# Altium project UZ_per_cb_upgrade.PrjPcb (part 3 of 3)

## Sheet SupplyMonitoring.SchDoc
size A4; SheetNumber: 9
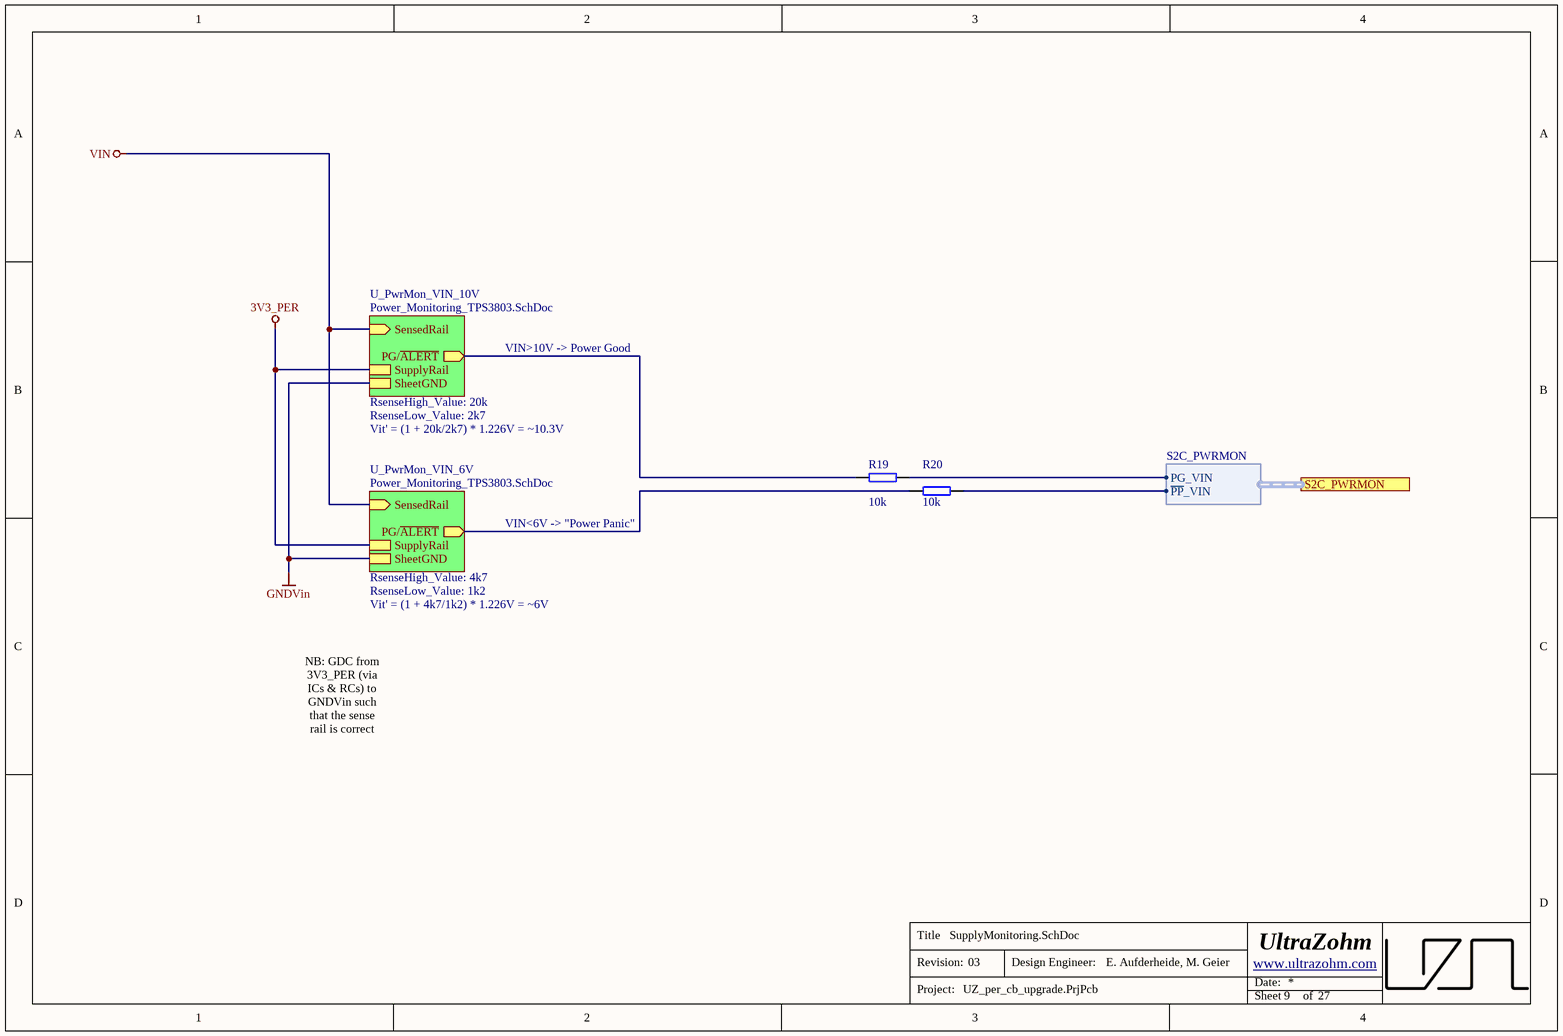
[diagram p18: SupplyMonitoring.SchDoc]

### Parts
R19  10k  [R_0603_TE]
R20  10k  [R_0603_TE]

### Sub-sheets
U_PwrMon_VIN_6V = Power_Monitoring_TPS3803.SchDoc (file not in this document): SensedRail (in), PG/~{ALERT} (out), SupplyRail, SheetGND  | RsenseHigh_Value: 4k7; RsenseLow_Value: 1k2; SubSheet_SheetNumber: 10.1
U_PwrMon_VIN_10V = Power_Monitoring_TPS3803.SchDoc (file not in this document): SensedRail (in), PG/~{ALERT} (out), SupplyRail, SheetGND  | RsenseHigh_Value: 20k; RsenseLow_Value: 2k7; SubSheet_SheetNumber: 10.2

### Ports
S2C_PWRMON (harness S2C_PWRMON)

### Harnesses
S2C_PWRMON: PG_VIN, ~{PP}_VIN

### Nets
3V3_PER: sheet U_PwrMon_VIN_10V/SupplyRail, sheet U_PwrMon_VIN_6V/SupplyRail
GNDVin: sheet U_PwrMon_VIN_10V/SheetGND, sheet U_PwrMon_VIN_6V/SheetGND
VIN: sheet U_PwrMon_VIN_10V/SensedRail, sheet U_PwrMon_VIN_6V/SensedRail
NetR19_1: R19.1 ; sheet U_PwrMon_VIN_10V/PG/~{ALERT}
NetR19_2: R19.2 ; port S2C_PWRMON.PG_VIN
NetR20_1: R20.1 ; sheet U_PwrMon_VIN_6V/PG/~{ALERT}
NetR20_2: R20.2 ; port S2C_PWRMON.~{PP}_VIN

### Notes on the sheet
- VIN>10V -> Power Good
- Vit' = (1 + 20k/2k7) * 1.226V = ~10.3V
- VIN<6V -> "Power Panic"
- Vit' = (1 + 4k7/1k2) * 1.226V = ~6V
- NB: GDC from 3V3_PER (via ICs & RCs) to GNDVin such that the sense rail is correct
- Title
- Revision:
- Design Engineer:
- Date:
- Project:
- Sheet
- of

### Library data of the parts
R19 R20 = UZgen_R_0603_10k: Generic resistor; Manufacturer: UZgen; Tolerance: 1 %; Created from: AGeiger; Value: 10k; Manufacturer Part Number: UZgen_R_0603_10k; PartID: 1; Created On: 02/07/2024 14:34:53; Device Package: 0603; Mounting Type: SMD; Last Updated: 02/07/2024 14:37:16

## Sheet ThermalExtSens.SchDoc
size A4; SheetNumber: 26
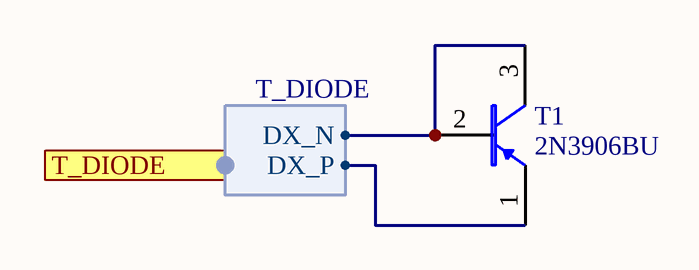
[diagram p19: ThermalExtSens.SchDoc]

### Parts
T1  2N3906BU  [TO-92-3]

### Ports
T_DIODE (harness T_DIODE)

### Harnesses
T_DIODE: DX_P, DX_N

### Nets
NetT1_1: T1.1(EMITTER) ; port T_DIODE.DX_P
NetT1_2: T1.2(BASIS) T1.3(COLLECTOR) ; port T_DIODE.DX_N

### Notes on the sheet
- Title
- Revision:
- Design Engineer:
- Date:
- Project:
- Sheet
- of

### Library data of the parts
T1 = 2N3906BU: Bipolartransistor, PNP; Manufacturer: onsemi; Number Of Channels: single; Collector Emitter Voltage: 40V; Power Dissipation: 625mW; Value: 40V; Created from: MGeier; Manufacturer Part Number: 2N3906BU; PartID: 4; Created On: 29/03/2025 21:55:00; ComponentLink1Description: Datasheet; ComponentLink1URL: https://www.onsemi.com/download/data-sheet/pdf/2n3906-d.pdf; Component Type: Bipolartransistor; Device Package: TO-92-3; Last Updated: 29/03/2025 21:55:00; Mounting Type: THT; Operating Temperature: -55 - 150°C; Series: 2N3906; Supplier 1: LCSC; Supplier Part Number 1: C124483; Type: Bipolartransistor; Collector Basis Voltage: 40V; Polarization: PNP; Live Cycle Status: 1; LCSC Part Number: C124483

## Sheet isoDebug-Isolation.SchDoc
size A4
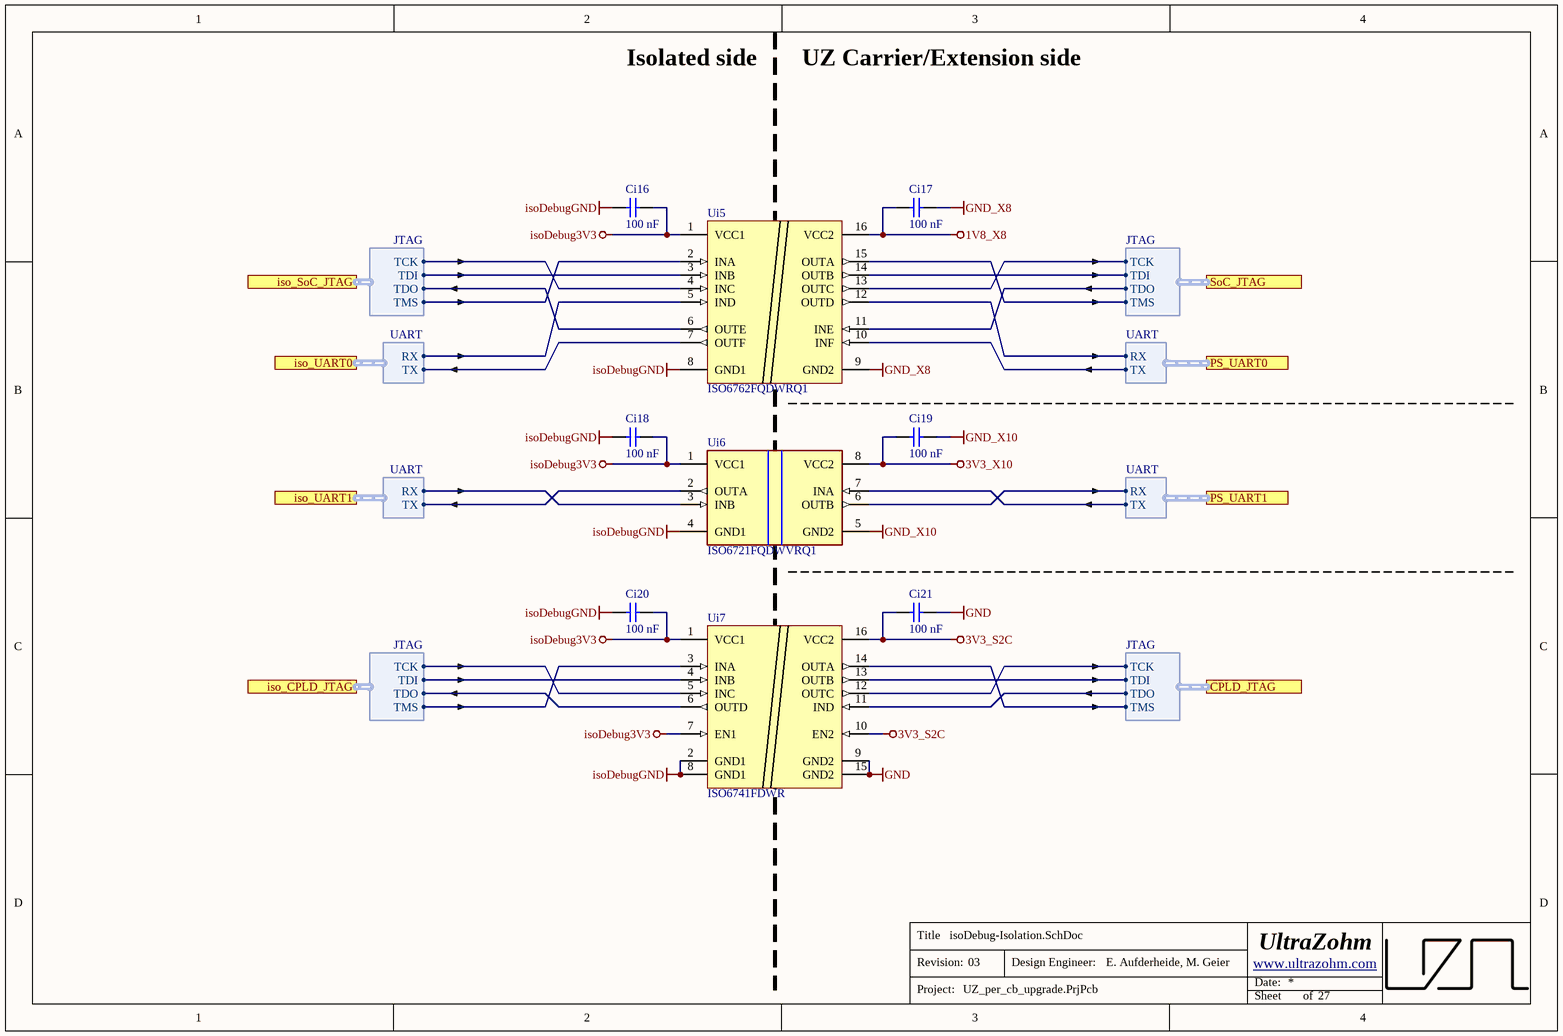
[diagram p20: isoDebug-Isolation.SchDoc]

### Parts
Ci16  100 nF  [C_0402_TE]
Ci17  100 nF  [C_0402_TE]
Ci18  100 nF  [C_0402_TE]
Ci19  100 nF  [C_0402_TE]
Ci20  100 nF  [C_0402_TE]
Ci21  100 nF  [C_0402_TE]
Ui5  ISO6762FQDWRQ1  [SOIC127P1030X265-16N]
Ui6  ISO6721FQDWVRQ1  [FP-DWV0008A-IPC_A]
Ui7  ISO6741FDWR  [SOIC127P1030X265-16N]

### Ports
CPLD_JTAG (harness JTAG), iso_CPLD_JTAG (harness JTAG), iso_SoC_JTAG (harness JTAG), iso_UART0 (harness UART), iso_UART1 (harness UART), PS_UART0 (harness UART), PS_UART1 (harness UART), SoC_JTAG (harness JTAG)

### Harnesses
JTAG: TCK, TDI, TDO, TMS
UART: RX, TX

### Nets
1V8_X8: Ci17.2 Ui5.16(VCC2)
3V3_S2C: Ci21.2 Ui7.10(EN2) Ui7.16(VCC2)
3V3_X10: Ci19.2 Ui6.8(VCC2)
GND: Ci21.1 Ui7.9(GND2) Ui7.15(GND2)
GND_X8: Ci17.1 Ui5.9(GND2)
GND_X10: Ci19.1 Ui6.5(GND2)
isoDebug3V3: Ci16.1 Ci18.1 Ci20.1 Ui5.1(VCC1) Ui6.1(VCC1) Ui7.1(VCC1) Ui7.7(EN1)
isoDebugGND: Ci16.2 Ci18.2 Ci20.2 Ui5.8(GND1) Ui6.4(GND1) Ui7.2(GND1) Ui7.8(GND1)
NetUi5_2: Ui5.2(INA) ; port iso_SoC_JTAG.TMS
NetUi5_3: Ui5.3(INB) ; port iso_SoC_JTAG.TDI
NetUi5_4: Ui5.4(INC) ; port iso_SoC_JTAG.TCK
NetUi5_5: Ui5.5(IND) ; port iso_UART0.RX
NetUi5_6: Ui5.6(OUTE) ; port iso_SoC_JTAG.TDO
NetUi5_7: Ui5.7(OUTF) ; port iso_UART0.TX
NetUi5_10: Ui5.10(INF) ; port PS_UART0.TX
NetUi5_11: Ui5.11(INE) ; port SoC_JTAG.TDO
NetUi5_12: Ui5.12(OUTD) ; port PS_UART0.RX
NetUi5_13: Ui5.13(OUTC) ; port SoC_JTAG.TCK
NetUi5_14: Ui5.14(OUTB) ; port SoC_JTAG.TDI
NetUi5_15: Ui5.15(OUTA) ; port SoC_JTAG.TMS
NetUi6_2: Ui6.2(OUTA) ; port iso_UART1.TX
NetUi6_3: Ui6.3(INB) ; port iso_UART1.RX
NetUi6_6: Ui6.6(OUTB) ; port PS_UART1.RX
NetUi6_7: Ui6.7(INA) ; port PS_UART1.TX
NetUi7_3: Ui7.3(INA) ; port iso_CPLD_JTAG.TMS
NetUi7_4: Ui7.4(INB) ; port iso_CPLD_JTAG.TDI
NetUi7_5: Ui7.5(INC) ; port iso_CPLD_JTAG.TCK
NetUi7_6: Ui7.6(OUTD) ; port iso_CPLD_JTAG.TDO
NetUi7_11: Ui7.11(IND) ; port CPLD_JTAG.TDO
NetUi7_12: Ui7.12(OUTC) ; port CPLD_JTAG.TCK
NetUi7_13: Ui7.13(OUTB) ; port CPLD_JTAG.TDI
NetUi7_14: Ui7.14(OUTA) ; port CPLD_JTAG.TMS

### Notes on the sheet
- Isolated side
- UZ Carrier/Extension side
- Title
- Revision:
- Design Engineer:
- Date:
- Project:
- Sheet
- of

### Library data of the parts
Ci16-Ci21 = UZgen_C_0402_100nF_50V_X7R: Generic capacitor; Manufacturer: UZgen; Tolerance: 10 %; Created from: UZgenTool; Voltage: 50V; Manufacturer Part Number: UZgen_C_0402_100nF_50V_X7R; PartID: 3431; Created On: 02/08/2024 11:17:51; Device Package: 0402; Last Updated: 02/08/2024 11:17:51; Mounting Type: SMD; Value: 100 nF; Technology: X7R
Ui5 = ISO6762FQDWRQ1: ISO676x General-Purpose Six-Channel Reinforced Digital Isolators with Robust EMC; Manufacturer: Texas Instruments; Created from: FRosner; Manufacturer Part Number: ISO6762FQDWRQ1; PartID: 13; Created On: 23/02/2025 18:15:58; ComponentLink1Description: Datasheet; ComponentLink1URL: https://www.ti.com/lit/ds/symlink/iso6762-q1.pdf; Component Type: Digital Isolator; Device Package: SOIC-16; Last Updated: 24/03/2025 19:50:00; Mounting Type: SMD; Operating Temperature: -40 to +125 °C; Series: ISO6762; Supplier 1: Mouser; Supplier Part Number 1: 595-ISO6762FQDWRQ1; Supplier 2: LCSC; Supplier Part Number 2: C5216383; Type: Digital Isolator; Value: ISO6762FQDWRQ1; LCSC Part Number: C5216383
Ui6 = ISO6721FQDWVRQ1: General Purpose Reinforced and Basic Dual-Channel Automotive Digital Isolators with Robust EMC; Manufacturer: Texas Instruments; Created from: FRosner; Manufacturer Part Number: ISO6721FQDWVRQ1; PartID: 14; Created On: 23/02/2025 18:26:28; ComponentLink1Description: Datasheet; ComponentLink1URL: https://www.ti.com/lit/ds/symlink/iso6721-q1.pdf; Component Type: Digital Isolator; Device Package: SOIC-8; Last Updated: 26/03/2025 16:07:30; Mounting Type: SMD; Operating Temperature: -40 to +125 °C; Series: ISO6721; Supplier 1: Mouser; Supplier Part Number 1: 595-ISO6721FQDWVRQ1; Supplier 2: LCSC; Supplier Part Number 2: C5216428; Type: Digital Isolator; Value: ISO6721FQDWVRQ1; LCSC Part Number: C5216428
Ui7 = ISO6741FDWR: Digital Isolators General-purpose, quad-channel, 3/1 digital isolator 16-SOIC -40 to 125; Manufacturer: Texas Instruments; Created from: FRosner; Manufacturer Part Number: ISO6741FDWR; PartID: 6; Created On: 18/06/2024 13:06:34; ComponentLink1Description: Datasheet; ComponentLink1URL: https://www.ti.com/lit/ds/symlink/iso6741.pdf; Component Type: Digital Isolator; Device Package: SOIC-16; Last Updated: 24/03/2025 19:50:00; Mounting Type: SMD; Operating Temperature: -40 to +125 °C; Series: ISO6741; Supplier 1: Mouser; Supplier Part Number 1: 595-ISO6741FDWR; Supplier 2: LCSC; Supplier Part Number 2: C5216433; Type: Digital Isolator; Value: ISO6741FDWR; LCSC Part Number: C5216433

## Nets that join several sheets
1V8_X8: isoDebug-Connectors (CB_X8.06), isoDebug-Isolation (Ci17.2 Ui5.16)
3V3_PER: Samtec_Connectors (11 pins), S2C_FrontpanelInterface (12 pins)
3V3_S2C: Top_sheet (NT2.2), RTC (C10.1 C11.1 U1.1 U1.8), U_EEPROM_MAC0 (C10A.1 U4A.8), U_EEPROM_MAC1 (C10B.1 U4B.8), EEPROM (5 pins), S2C (11 pins), S2C_IOs3V3 (25 pins), S2C_IOs3V3_SelectSPI (6 pins), S2C_IOs1V8 (11 pins), S2C_IOsVIO (X1.06), S2C_FrontpanelInterface (R52.1), S2C_SelectJTAG (8 pins), isoDebug-Connectors (R56.2), X10-Isolation (C75.2 C77.2 U15.1 U16.16), X13-Isolation (6 pins), isoDebug-Isolation (Ci21.2 Ui7.10 Ui7.16)
3V3_SSD: SSD (24 pins), Power_Supplies (D2.2 R15.1)
3V3_X10: Samtec_Connectors (8 pins), X10-Isolation (C74.1 C76.1 U15.8 U16.1), isoDebug-Isolation (Ci19.2 Ui6.8)
3V3_X13: Samtec_Connectors (CB_X13.1 CB_X13.4 CB_X13.7 CB_X13.10), X13-Isolation (6 pins)
GND: Top_sheet (NT1.2 R1.2 Rc1.2), RTC (7 pins), U_EEPROM_MAC0 (C10A.2 U4A.1 U4A.3 U4A.4), U_EEPROM_MAC1 (C10B.2 U4B.1 U4B.3 U4B.4), EEPROM (C12.2 U2.3 U2.4), S2C (16 pins), S2C_IOs3V3 (20 pins), S2C_IOs3V3_SelectSPI (C51.1 C52.1 U6.2 U7.2), S2C_IOs1V8 (17 pins), S2C_IOsVIO (C63.2 C64.1 X1.07), S2C_SelectJTAG (11 pins), isoDebug-Connectors (R55.2), X10-Isolation (5 pins), X13-Isolation (9 pins), isoDebug-Isolation (Ci21.1 Ui7.9 Ui7.15)
GND_FP: Samtec_Connectors (11 pins), S2C_FrontpanelInterface (10 pins)
GND_X8: isoDebug-Connectors (CB_X8.01 CB_X8.02), isoDebug-Isolation (Ci17.1 Ui5.9)
GND_X10: Samtec_Connectors (C1.1 C2.2 CB_X10.2 CB_X10.8), X10-Isolation (5 pins), isoDebug-Isolation (Ci19.1 Ui6.5)
GND_X13: Samtec_Connectors (CB_X13.11 CB_X13.14 CB_X13.17 CB_X13.20), X13-Isolation (9 pins)
GNDSSD: Top_sheet (R1.1), SSD (49 pins), Power_Supplies (6 pins)
GNDVin: Samtec_Connectors (CB_X18.3 CB_X18.4 CB_X18.16 CB_X18.17), Power_Supplies (C26.2 C28.2 R18.2 U4.2)
isoDebugGND: isoDebug-Connectors (9 pins), isoDebug-Isolation (7 pins)
VIN: Samtec_Connectors (6 pins), Power_Supplies (C26.1 C28.1 U4.1), S2C_FrontpanelInterface (C72.2 U14.1 U14.2)
1V8_S2C: S2C_IOs1V8 (8 pins), S2C_IOsVIO (X1.05)
DONE: S2C_IOs3V3 (U5.76), S2C_SelectJTAG (R42.1 R43.2)
EEPROM_MAC_A1-: Top_sheet (NT1.1), U_EEPROM_MAC0 (U4A.2)
EEPROM_MAC_A1-: Top_sheet (NT2.1), U_EEPROM_MAC1 (U4B.2)
FOUT: RTC (U1.4), S2C_IOs3V3 (U5.63)
FP_SysLEDs: S2C_IOs3V3 (U5.40), S2C_FrontpanelInterface (R52.2 R53.1)
FP_UsrLED1: S2C (R24.1), S2C_IOs3V3 (U5.35)
FP_UsrLED1R: S2C (R24.2), S2C_FrontpanelInterface (U13.1)
FP_UsrLED2: S2C (R22.1), S2C_IOs3V3 (U5.34)
FP_UsrLED2R: S2C (R22.2), S2C_FrontpanelInterface (U13.2)
FP_UsrLED3: S2C (R23.1), S2C_IOs3V3 (U5.30)
FP_UsrLED3R: S2C (R23.2), S2C_FrontpanelInterface (U13.3)
FP_UsrLED4: S2C (R21.1), S2C_IOs3V3 (U5.29)
FP_UsrLED4R: S2C (R21.2), S2C_FrontpanelInterface (U13.4)
FP_UsrSW1: S2C (R26.1), S2C_IOs3V3 (U5.38)
FP_UsrSW1R: S2C (R26.2), S2C_FrontpanelInterface (R49.1 U12.17)
FP_UsrSW2: S2C (R28.1), S2C_IOs3V3 (U5.37)
FP_UsrSW2R: S2C (R28.2), S2C_FrontpanelInterface (R50.1 U12.16)
FP_UsrSW3: S2C (R27.1), S2C_IOs3V3 (U5.39)
FP_UsrSW3R: S2C (R27.2), S2C_FrontpanelInterface (R48.1 U12.18)
FP_UsrSW4: S2C (R29.1), S2C_IOs3V3 (U5.36)
FP_UsrSW4R: S2C (R29.2), S2C_FrontpanelInterface (R51.1 U12.15)
JTAGEN_S2C~{DCs}: S2C (D3.2), S2C_SelectJTAG (R47.2 U11.3 U11.4)
nCS: S2C_IOs3V3_SelectSPI (U6.1 U7.3), X10-Isolation (U16.14)
nCS_SYS: S2C_IOs3V3 (U5.48), S2C_IOs3V3_SelectSPI (U7.4)
nCS_USR: S2C_IOs3V3 (U5.47), S2C_IOs3V3_SelectSPI (U6.4)
NetR19_2: S2C_IOs3V3 (U5.27), SupplyMonitoring (R19.2)
NetR20_2: S2C_IOs3V3 (U5.28), SupplyMonitoring (R20.2)
NetR25_1: RTC (U1.2), U_EEPROM_MAC0 (U4A.6), U_EEPROM_MAC1 (U4B.6), EEPROM (U2.6), S2C (R25.1), S2C_IOs3V3 (R37.1), X10-Isolation (U15.2)
NetR30_1: RTC (U1.3), U_EEPROM_MAC0 (U4A.5), U_EEPROM_MAC1 (U4B.5), EEPROM (U2.5), S2C (R30.1), S2C_IOs3V3 (R39.1), X10-Isolation (U15.3)
NetR31_1: Top_sheet (Xc1.04), S2C (R31.1), S2C_IOs3V3 (R38.1)
NetR32_1: Top_sheet (Xc1.03), S2C (R32.1), S2C_IOs3V3 (R40.1)
NetU5_31: S2C_IOs3V3 (U5.31), X10-Isolation (U16.12)
NetU5_32: S2C_IOs3V3 (U5.32), X10-Isolation (U16.11)
NetU5_49: S2C_IOs3V3 (U5.49), X10-Isolation (U16.13)
~{SwitchToS2CJTAG}: S2C (C30.2 R33.1 R34.2), S2C_SelectJTAG (U9.6)
SPI0_Sel~{SYS}USRnCS: S2C_IOs3V3 (R41.2 U5.45), S2C_IOs3V3_SelectSPI (U6.6 U7.6)

## Assembly variants
Default: not fitted Ct1 MECH1a R36 Rt6 T1 X_USB1